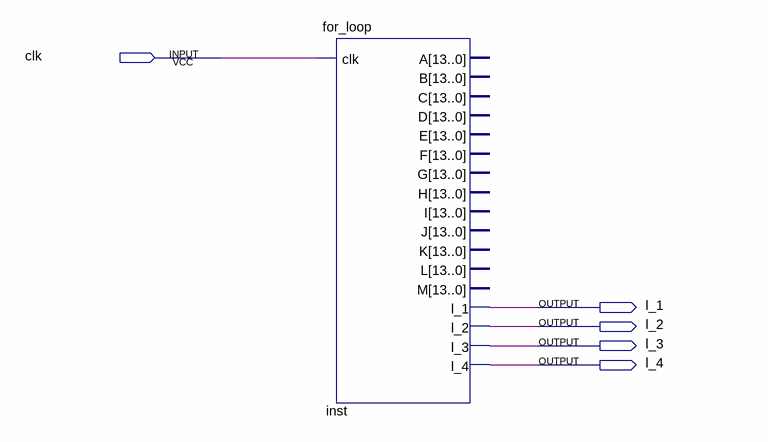
[diagram p0: schematic sheet]
// Quartus schematic f_b.bdf as structural Verilog: 1 symbols, 5 pins
module f_b (
  input  clk,
  output l_1,
  output l_2,
  output l_3,
  output l_4
);

  for_loop inst (.clk(clk), .l_1(l_1), .l_2(l_2), .l_3(l_3), .l_4(l_4));  // open: A, B, C, D, E, F, G, H, I, J, K, L, M
endmodule
